# EAGLE design Vibrationdriver_WS2811 (EAGLE 7.1.0)
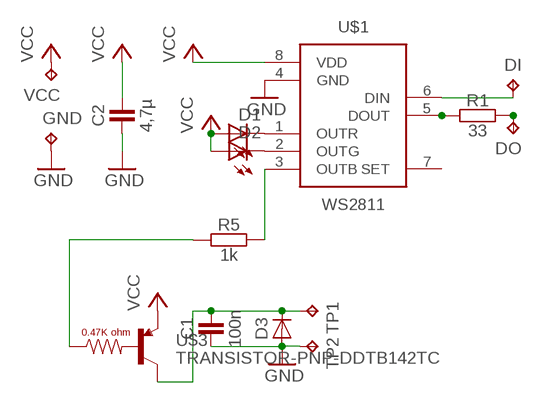
[diagram p0: schematic, sheet 1]

## Parts
C1  100n  CAPACITOR-0603  [C0603]
C2  4,7µ  CAPACITOR-0603  [C0603]
D1  LED-0603  [C0603]
D2  LED-0603  [C0603]
D3  DIODE-SOD110  [SOD110]
DI  TPTP08SQ  [TP08SQ]
DO  TPTP08SQ  [TP08SQ]
GND  TPTP08SQ  [TP08SQ]
R1  33  RESISTOR-0603  [C0603]
R5  1k  RESISTOR-0603  [C0603]
TP1  TPTP20R  [TP20R]
TP2  TPTP20R  [TP20R]
U$1  WS2811  [SOP-8]
U$3  TRANSISTOR-PNP-DDTB142TC  [SOT23-3]
VCC  TPTP08SQ  [TP08SQ]

## Nets
DIN: DI.TP U$1.6(DIN)
GND: C1.1 C2.1 D3.A GND.TP TP2.TP U$1.4(GND)
N$1: C1.2 D3.C TP1.TP U$3.3(C)
N$2: R1.1 U$1.5(DOUT)
N$3: DO.TP R1.2
N$7: D1.C U$1.1(OUTR)
N$8: D2.C U$1.2(OUTG)
N$10: R5.1 U$3.1(B)
N$11: R5.2 U$1.3(OUTB)
VCC: C2.2 D1.A D2.A U$1.8(VDD) U$3.2(E) VCC.TP
Unconnected: U$1.7(SET)

## Library data of the parts
C1 C2 = we-rcl:CAPACITOR: Capacitors ...4.7uF @ 6.3V -> 0402 ...10uF @ 16V -> 0603 ...22uF @ 25V -> 0805
D1 D2 = we-opto:LED: LEDs
D3 = we-rcl:DIODE: Diodes
DI DO GND TP1 TP2 VCC = testpad:TP: Test pad
R1 R5 = we-rcl:RESISTOR: Resistors all kinds in 0603 and 0402
U$1 = thar:WS2811
U$3 = SparkFun-DiscreteSemi:TRANSISTOR-PNP-DDTB142TC

## Board
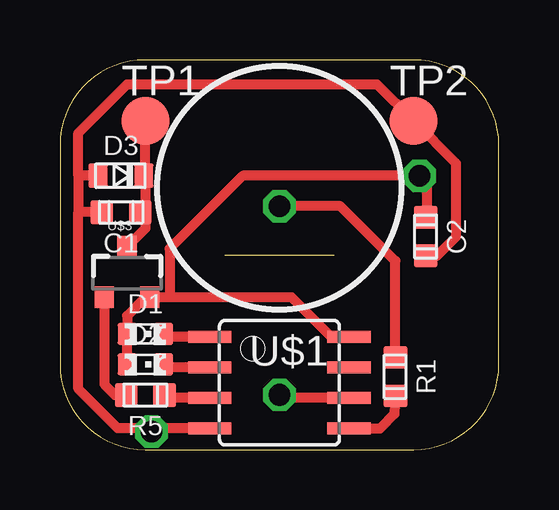
[diagram p1: board, top side]
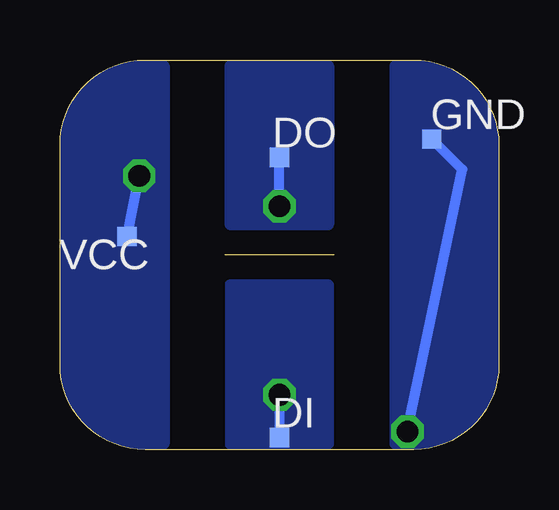
[diagram p2: board, bottom side, seen from below]

Size 18.29 x 16.26 mm. Coordinates in mm from the lower left corner, seen from the top.
Outline: 6.86,8.13 11.43,8.13
Outline: 14.73,0 arc90 18.29,3.56 18.29,12.7 arc90 14.73,16.26 3.56,16.26 arc90 0,12.7 0,3.56 arc90 3.56,0 14.73,0
Copper layers (1*16): Top 0.035mm / dielectric 1.5mm / Bottom 0.035mm
Design rules "default *": minimum track width 10mil, minimum drill 24mil, track to track 8mil, track to pad 8mil, pad to pad 8mil, via to via 8mil, smd to smd 8mil, copper to edge 1mil, drill to drill 8mil, minimum pad ring 10mil, minimum via ring 8mil, stop-mask expansion 4mil, vias tented up to drill 0mil, thermal gap 10mil

### Footprints (pad centres in the part's own frame; a part is rotated, then mirrored left to right if it is on the bottom)
C0603 = smd 1 x 0.95: 1 0,0.8; 2 0,-0.8
C0603' = smd 0.9 x 0.8: A 0,-0.75; C 0,0.75
SOD110 = smd 1 x 0.8: A 0,-0.95; C 0,0.95
TP08SQ = smd 0.8 x 0.8: TP 0,0
TP20R = smd 2 x 2: TP 0,0
SOP-8 = smd 1.8 x 0.5: 1 -2.9,1.905; 2 -2.9,0.645; 3 -2.9,-0.625; 4 -2.9,-1.895; 5 2.9,-1.905; 6 2.9,-0.635; 7 2.9,0.635; 8 2.9,1.905
SOT23-3 = smd 0.8 x 0.9: 1 -0.95,-1; 2 0.95,-1; 3 0,1.1

### Placement (x,y rotation side)
C1  2.54,9.91 90 top
C2  15.24,8.89 180 top
D1  [C0603']  3.56,4.83 270 top
D2  [C0603']  3.56,3.56 270 top
D3  2.54,11.43 270 top
DI  9.14,0.51 0 bottom
DO  9.14,12.19 0 bottom
GND  2.79,12.95 0 bottom
R1  13.97,3.05 180 top
R5  3.56,2.29 90 top
TP1  3.56,13.72 0 top
TP2  14.73,13.72 0 top
U$1  9.14,2.79 0 top
U$3  2.79,7.37 0 top
VCC  15.49,8.89 0 bottom

### Tracks (layer width: path | path; a pad name or v marks a point on that pad's centre or on a via)
DIN  (via drill 0.9)
  Top 0.406: U$1.6 9.27,2.16 v9.14,2.29
  Bottom 0.406: v9.14,2.29 DI.TP
  pour Bottom (no thermals): 7.11,6.86 11.18,6.86 11.18,0.25 7.11,0.25
GND  (via drill 0.9)
  Top 0.406: U$1.4 3.56,0.9 | 3.56,0.9 2.4,0.9 0.76,2.54 0.76,9.91 | C1.1 0.76,9.91 | 0.76,11.43 0.76,13.21 2.79,15.24 13.21,15.24 TP2.TP 16.51,11.94 16.51,8.89 15.71,8.09 C2.1 | D3.A 0.76,11.43 | 0.76,11.43 0.76,9.91 | v3.81,0.76 3.69,0.76 3.56,0.9
  Bottom 0.406: v3.81,0.76 1.52,11.68 GND.TP
  pour Bottom (no thermals): 4.32,16 4.32,0.25 3.56,0.25 arc-103 0.25,3.56 0.25,12.7 arc-100 3.56,16
N$1
  Top 0.406: 3.56,11.43 3.56,10.12 C1.2 3.56,9.91 3.56,9.23 U$3.3 | D3.C 3.56,11.43 | 3.56,11.43 TP1.TP
N$2
  Top 0.406: R1.1 13.93,1.49 13.33,0.89 U$1.5
N$3  (via drill 0.9)
  Top 0.406: 13.97,3.81 R1.2 13.97,7.87 11.68,10.16 v9.14,10.16
  Bottom 0.406: v9.14,10.16 DO.TP
  pour Bottom (no thermals): 7.11,16 7.11,9.4 11.18,9.4 11.18,16
N$7
  Top 0.406: U$1.1 4.31,4.7 D1.C
N$8
  Top 0.406: U$1.2 4.31,3.44 D2.C
N$10
  Top 0.406: U$3.1 1.84,2.73 2.29,2.29 R5.1
N$11
  Top 0.406: U$1.3 4.36,2.17 R5.2
VCC  (via drill 0.9)
  Top 0.406: D2.A D1.A 2.79,4.84 2.79,5.59 3.57,6.37 U$3.2 4.57,6.37 | U$1.8 11.3,4.7 9.64,6.37 4.57,6.37 | 4.57,6.37 4.57,8.38 7.62,11.43 v14.99,11.43 15.31,11.11 15.31,9.72 15.28,9.69 C2.2
  Bottom 0.406: VCC.TP v14.99,11.43
  pour Bottom (no thermals): 13.97,16 13.97,0.25 14.73,0.25 arc100 18.03,3.56 18.03,12.95 arc91 14.99,16